# Altium schematic sheet LV_supplies.SchDoc: Low-voltage power supplies
size A4; Author: L. Sartory; Organization: L. Sartory; Address2: Nixie clock; Address3: with GPS synchronization; DocumentNumber: 11; Revision: B1; SheetNumber: 11; SheetTotal: 12
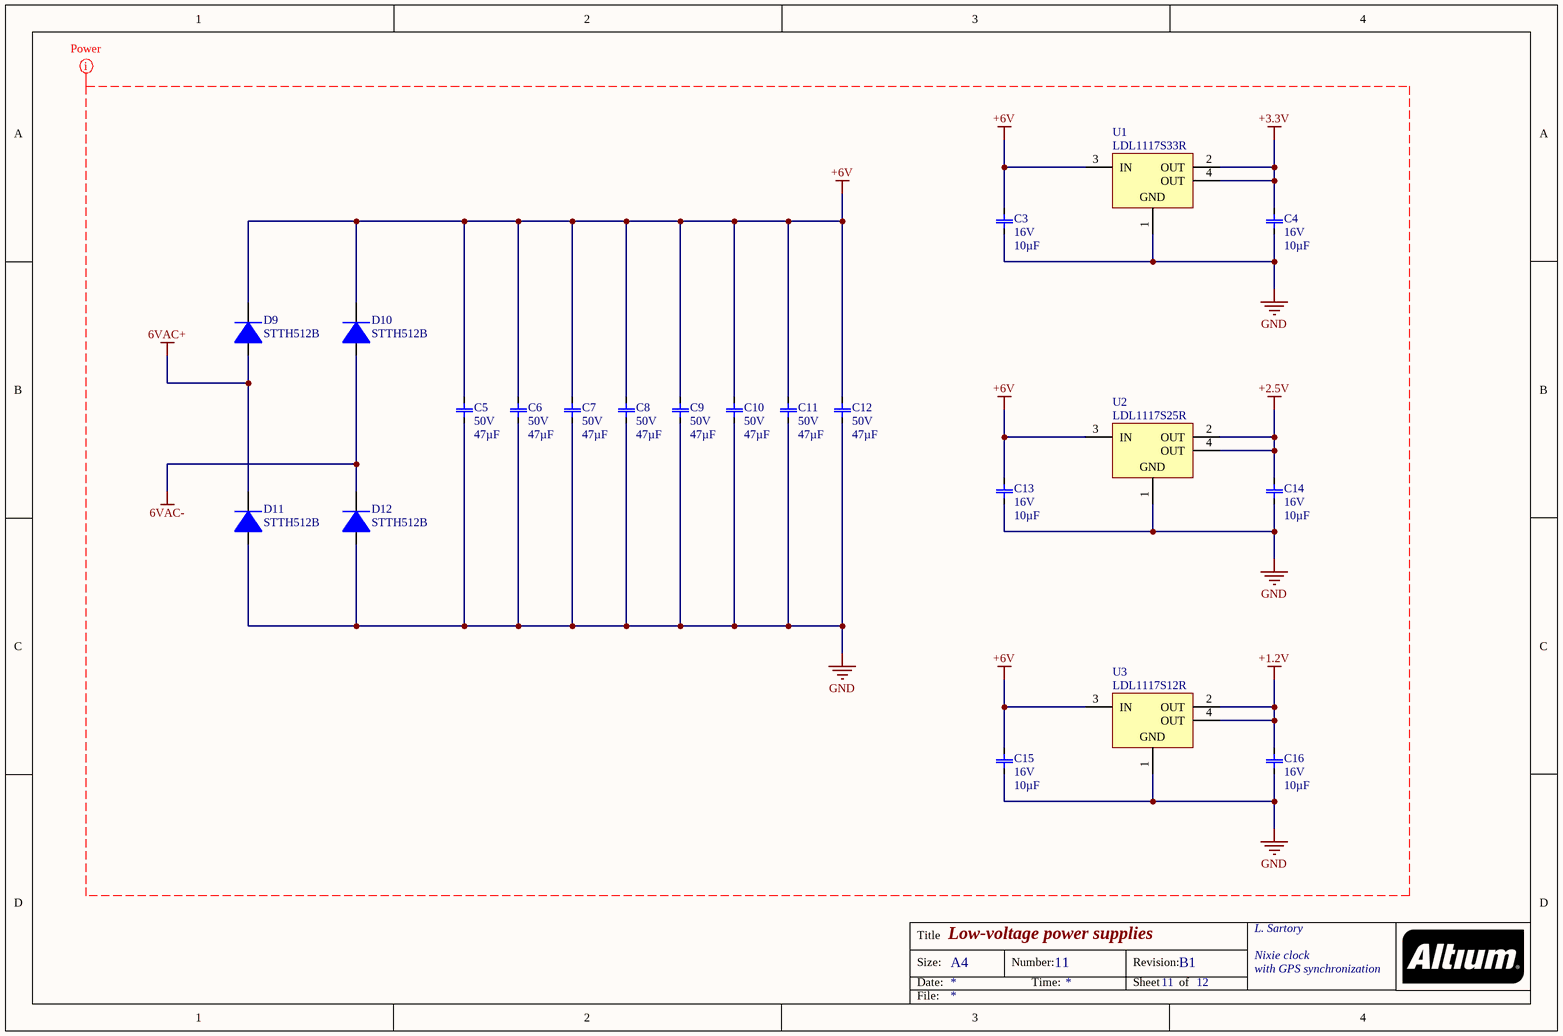
[diagram p0: LV_supplies.SchDoc]

## Parts
C3  Voltage: 16V  [MLCC_1210]  (hidden comment: 10µF)
C4  Voltage: 16V  [MLCC_1210]  (hidden comment: 10µF)
C5  Voltage: 50V  [MLCC_1210]  (hidden comment: 47µF)
C6  Voltage: 50V  [MLCC_1210]  (hidden comment: 47µF)
C7  Voltage: 50V  [MLCC_1210]  (hidden comment: 47µF)
C8  Voltage: 50V  [MLCC_1210]  (hidden comment: 47µF)
C9  Voltage: 50V  [MLCC_1210]  (hidden comment: 47µF)
C10  Voltage: 50V  [MLCC_1210]  (hidden comment: 47µF)
C11  Voltage: 50V  [MLCC_1210]  (hidden comment: 47µF)
C12  Voltage: 50V  [MLCC_1210]  (hidden comment: 47µF)
C13  Voltage: 16V  [MLCC_1210]  (hidden comment: 10µF)
C14  Voltage: 16V  [MLCC_1210]  (hidden comment: 10µF)
C15  Voltage: 16V  [MLCC_1210]  (hidden comment: 10µF)
C16  Voltage: 16V  [MLCC_1210]  (hidden comment: 10µF)
D9  STTH512B  [STTH512B]
D10  STTH512B  [STTH512B]
D11  STTH512B  [STTH512B]
D12  STTH512B  [STTH512B]
U1  LDL1117S33R  [TLV1117]
U2  LDL1117S25R  [TLV1117]
U3  LDL1117S12R  [TLV1117]

## Nets
6VAC+: D9.A D11.K
6VAC-: D10.A D12.K
+1.2V: C16.2 U3.2(OUT) U3.4(OUT)
+2.5V: C14.2 U2.2(OUT) U2.4(OUT)
+3.3V: C4.2 U1.2(OUT) U1.4(OUT)
+6V: C3.2 C5.2 C6.2 C7.2 C8.2 C9.2 C10.2 C11.2 C12.2 C13.2 C15.2 D9.K D10.K U1.3(IN) U2.3(IN) U3.3(IN)
GND: C3.1 C4.1 C5.1 C6.1 C7.1 C8.1 C9.1 C10.1 C11.1 C12.1 C13.1 C14.1 C15.1 C16.1 D11.A D12.A U1.1(GND) U2.1(GND) U3.1(GND)

## Layout directives
net class Power: 6VAC+, 6VAC-, +1.2V, +2.5V, +3.3V, +6V, GND

## Notes on the sheet
- Title
- Size:
- Date:
- A4
- Number:
- Time:
- Revision:
- Sheet
- of
- File:

## Library data of the parts
C3 C4 C13-C16 = MLCC 10µF 16V 1210: Value: 10µF
C5-C12 = MLCC 47µF 50V 1210: Value: 47µF
D9-D12 = STTH512B: Ultrafast recovery - 1200 V diode; HelpURL: https://datasheet.ciiva.com/6374/cd00096465-6374991.pdf
U1 = LDL1117S33R: Fixed LDO Voltage Regulator, 2.6 V to 18 V input, 75 mV Dropout, 3.3 V / 1.2 A out, SOT-223-4; PartNumber: TLV1117LV12DCYT; Manufacturer: Texas Instruments; Fixed Output Options(V): 1.2; Vdo(Typ)(mV): 1200; SubFamily: Single Channel LDO; Vin(Min)(V): 2; Vin(Max)(V): 5.5; Eco-Plan: Green (RoHS & no Sb/Br); Iout(Max)(A): 1; Iq(Typ)(mA): 0.05; PackageVersion: 4202506/B; ComponentLink2URL: http://www.ti.com/general/docs/lit/getliterature.tsp?genericPartNumber=TLV1117LV12&fileType=pdf; ComponentLink2Description: Datasheet; ComponentLink3Description: Package Specification; Vout Adj(Max)(V): 1.2; ComponentLink1Description: Manufacturer URL; DatasheetVersion: SBVS160A; PackageDescription: 4-Pin Plastic Small Outline, Body 3.5 x 6.5 mm, Pitch 2.3 mm; ComponentLink1URL: http://www.ti.com/; PackageReference: DCY0004A; Code_JEDEC: TO-261; Accuracy(%): 2; Mounting Technology: Surface Mount; Vout Adj(Min)(V): 1.2; ComponentLink3URL: http://www.ti.com/litv/pdf/mpds094a
U2 = LDL1117S25R: Fixed LDO Voltage Regulator, 2.6 V to 18 V input, 75 mV Dropout, 2.5 V / 1.2 A out, SOT-223-4; Manufacturer: Texas Instruments; PartNumber: TLV1117LV25DCYT; Fixed Output Options(V): 2.5; Accuracy(%): 2; Iq(Typ)(mA): 0.05; Eco-Plan: Green (RoHS & no Sb/Br); Vdo(Typ)(mV): 1200; Iout(Max)(A): 1; Vin(Max)(V): 5.5; SubFamily: Single Channel LDO; ComponentLink3URL: http://www.ti.com/litv/pdf/mpds094a; DatasheetVersion: SBVS160A; PackageVersion: 4202506/B; Mounting Technology: Surface Mount; PackageDescription: 4-Pin Plastic Small Outline, Body 3.5 x 6.5 mm, Pitch 2.3 mm; ComponentLink2Description: Datasheet; ComponentLink3Description: Package Specification; ComponentLink2URL: http://www.ti.com/general/docs/lit/getliterature.tsp?genericPartNumber=TLV1117LV25&fileType=pdf; Code_JEDEC: TO-261; Vout Adj(Min)(V): 2.5; Vin(Min)(V): 2; PackageReference: DCY0004A; ComponentLink1Description: Manufacturer URL; ComponentLink1URL: http://www.ti.com/; Vout Adj(Max)(V): 2.5
U3 = LDL1117S12R: Fixed LDO Voltage Regulator, 2.6 V to 18 V input, 170 mV Dropout, 1.2 V / 1.2 A out, SOT-223-4; Manufacturer: Texas Instruments; PartNumber: TLV1117LV30DCYT; Vout Adj(Min)(V): 3; Iout(Max)(A): 1; Vin(Max)(V): 5.5; Vdo(Typ)(mV): 1200; Accuracy(%): 2; SubFamily: Single Channel LDO; Iq(Typ)(mA): 0.05; Eco-Plan: Green (RoHS & no Sb/Br); PackageVersion: 4202506/B; ComponentLink2URL: http://www.ti.com/general/docs/lit/getliterature.tsp?genericPartNumber=TLV1117LV30&fileType=pdf; ComponentLink3URL: http://www.ti.com/litv/pdf/mpds094a; ComponentLink3Description: Package Specification; Mounting Technology: Surface Mount; PackageDescription: 4-Pin Plastic Small Outline, Body 3.5 x 6.5 mm, Pitch 2.3 mm; DatasheetVersion: SBVS160A; Fixed Output Options(V): 3; Vin(Min)(V): 2; PackageReference: DCY0004A; Code_JEDEC: TO-261; ComponentLink2Description: Datasheet; ComponentLink1Description: Manufacturer URL; ComponentLink1URL: http://www.ti.com/; Vout Adj(Max)(V): 3